# EAGLE design Steuerplatine (EAGLE 9.4.2)
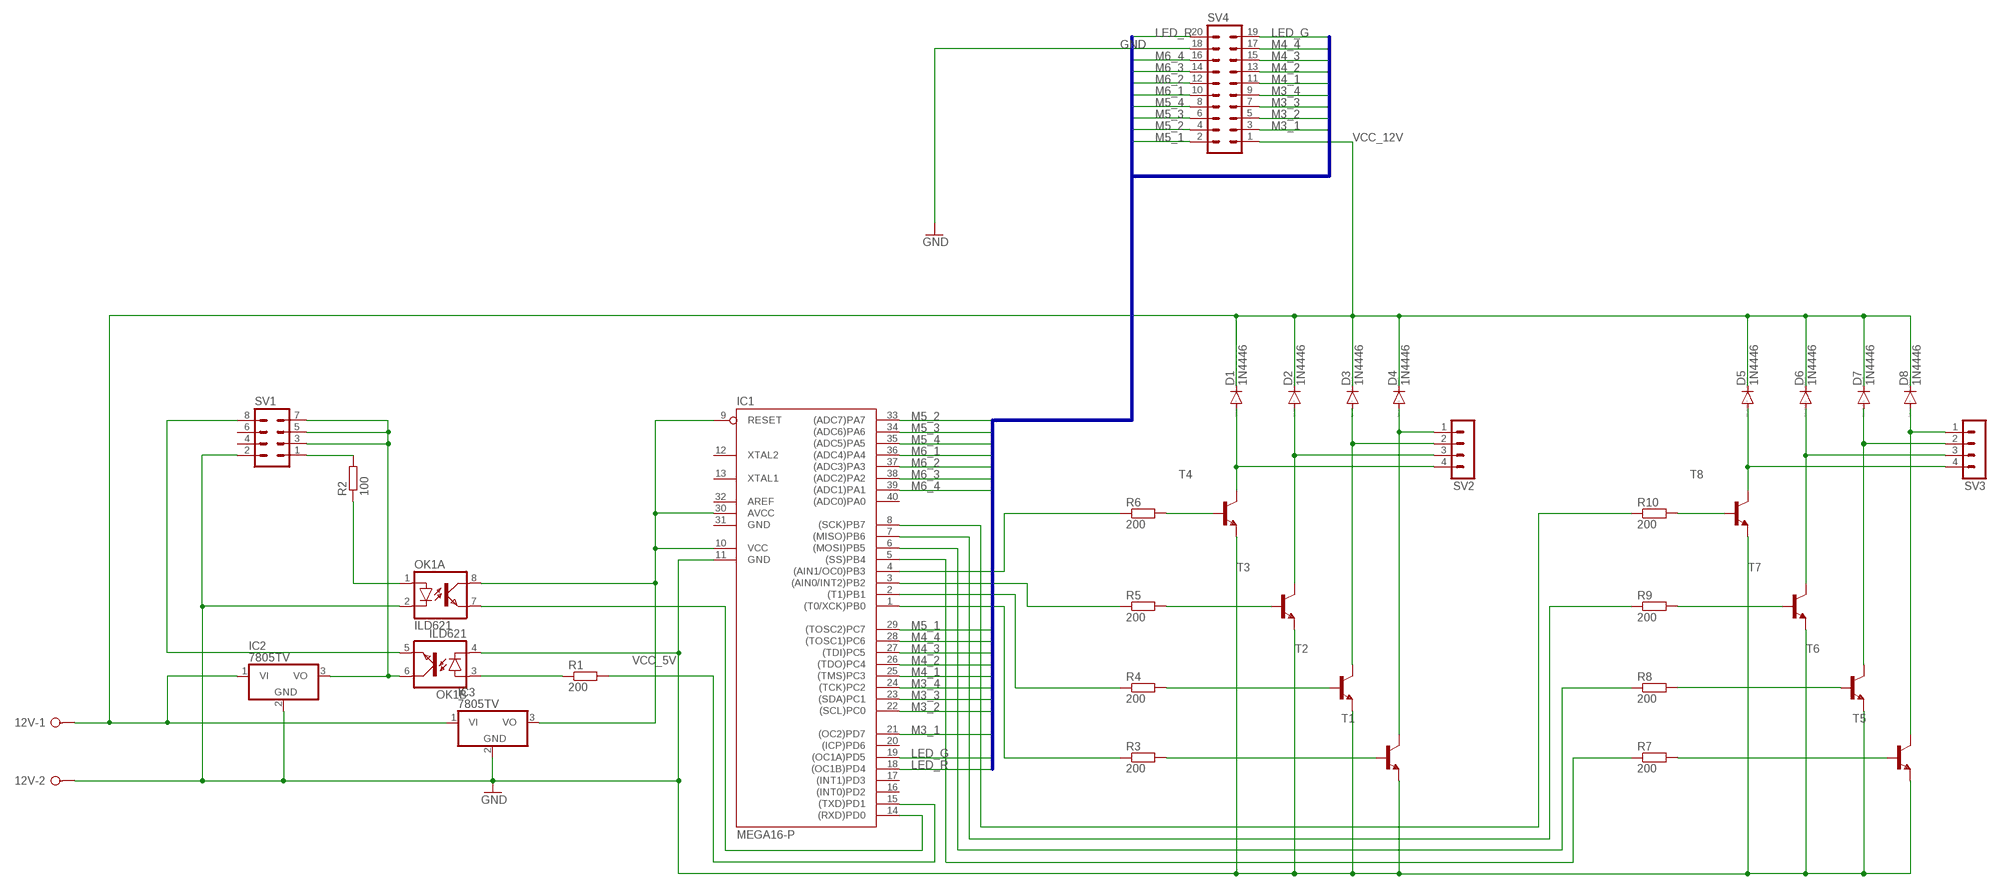
[diagram p0: schematic, sheet 1]

## Parts
12V  W237-02P  [W237-132]
D1  1N4446  [DO35-10]
D2  1N4446  [DO35-10]
D3  1N4446  [DO35-10]
D4  1N4446  [DO35-10]
D5  1N4446  [DO35-10]
D6  1N4446  [DO35-10]
D7  1N4446  [DO35-10]
D8  1N4446  [DO35-10]
IC1  MEGA16-P  [DIL40]
IC2  7805TV  [TO220V]
IC3  7805TV  [TO220V]
OK1  ILD621  [DIL08]
R1  200  R-EU_0207/10  [0207/10]
R2  100  R-EU_0207/10  [0207/10]
R3  200  R-EU_0207/10  [0207/10]
R4  200  R-EU_0207/10  [0207/10]
R5  200  R-EU_0207/10  [0207/10]
R6  200  R-EU_0207/10  [0207/10]
R7  200  R-EU_0207/10  [0207/10]
R8  200  R-EU_0207/10  [0207/10]
R9  200  R-EU_0207/10  [0207/10]
R10  200  R-EU_0207/10  [0207/10]
SV1  MA04-2  [MA04-2]
SV2  MA04-1  [MA04-1]
SV3  MA04-1  [MA04-1]
SV4  MA10-2  [MA10-2]
T1  -NPN-TO126V  [TO126V]
T2  -NPN-TO126V  [TO126V]
T3  -NPN-TO126V  [TO126V]
T4  -NPN-TO126V  [TO126V]
T5  -NPN-TO126V  [TO126V]
T6  -NPN-TO126V  [TO126V]
T7  -NPN-TO126V  [TO126V]
T8  -NPN-TO126V  [TO126V]

## Nets
GND: 12V.2 IC1.11(GND) IC2.2(GND) IC3.2(GND) OK1.2(A:C) OK1.4(B:C) SV1.2 SV4.18 T1.1(E) T2.1(E) T3.1(E) T4.1(E) T5.1(E) T6.1(E) T7.1(E) T8.1(E)
LED_G: IC1.19((OC1A)PD5) SV4.19
LED_R: IC1.18((OC1B)PD4) SV4.20
M3_1: IC1.21((OC2)PD7) SV4.3
M3_2: IC1.22((SCL)PC0) SV4.5
M3_3: IC1.23((SDA)PC1) SV4.7
M3_4: IC1.24((TCK)PC2) SV4.9
M4_1: IC1.25((TMS)PC3) SV4.11
M4_2: IC1.26((TDO)PC4) SV4.13
M4_3: IC1.27((TDI)PC5) SV4.15
M4_4: IC1.28((TOSC1)PC6) SV4.17
M5_1: IC1.29((TOSC2)PC7) SV4.2
M5_2: IC1.33((ADC7)PA7) SV4.4
M5_3: IC1.34((ADC6)PA6) SV4.6
M5_4: IC1.35((ADC5)PA5) SV4.8
M6_1: IC1.36((ADC4)PA4) SV4.10
M6_2: IC1.37((ADC3)PA3) SV4.12
M6_3: IC1.38((ADC2)PA2) SV4.14
M6_4: IC1.39((ADC1)PA1) SV4.16
N$1: R10.2 T8.3(B)
N$2: IC2.3(VO) OK1.6(B:COL) SV1.3 SV1.5 SV1.7
N$3: R2.2 SV1.1
N$4: IC1.14((RXD)PD0) OK1.7(A:EMIT)
N$5: IC1.15((TXD)PD1) R1.2
N$6: OK1.3(B:A) R1.1
N$7: OK1.5(B:EMIT) SV1.8
N$8: OK1.1(A:A) R2.1
N$9: R6.2 T4.3(B)
N$10: R5.2 T3.3(B)
N$11: R4.2 T2.3(B)
N$12: R3.2 T1.3(B)
N$13: IC1.1((T0/XCK)PB0) R3.1
N$14: IC1.2((T1)PB1) R4.1
N$15: IC1.3((AIN0/INT2)PB2) R5.1
N$16: IC1.4((AIN1/OC0)PB3) R6.1
N$18: D3.A SV2.2 T2.2(C)
N$19: D4.A SV2.1 T1.2(C)
N$20: D2.A SV2.3 T3.2(C)
N$21: D1.A SV2.4 T4.2(C)
N$24: R9.2 T7.3(B)
N$25: R8.2 T6.3(B)
N$26: R7.2 T5.3(B)
N$27: D6.A SV3.3 T7.2(C)
N$28: IC1.5((SS)PB4) R7.1
N$29: IC1.6((MOSI)PB5) R8.1
N$30: IC1.7((MISO)PB6) R9.1
N$31: IC1.8((SCK)PB7) R10.1
N$32: D7.A SV3.2 T6.2(C)
N$33: D8.A SV3.1 T5.2(C)
N$35: D5.A SV3.4 T8.2(C)
VCC_5V: IC1.9(RESET) IC1.10(VCC) IC1.30(AVCC) IC3.3(VO) OK1.8(A:COL)
VCC_12V: 12V.1 D1.C D2.C D3.C D4.C D5.C D6.C D7.C D8.C IC2.1(VI) IC3.1(VI) SV4.1
Unconnected: IC1.12(XTAL2) IC1.13(XTAL1) IC1.16((INT0)PD2) IC1.17((INT1)PD3) IC1.20((ICP)PD6) IC1.32(AREF) IC1.40((ADC0)PA0) SV1.4 SV1.6

## Buses
LED_G,LED_R,M3_1,M3_2,M3_3,M3_4,M4_1,M4_2,M4_3,M4_4,M5_1,M5_2,M5_3,M5_4,M6_1,M6_2,M6_3,M6_4

## Power pins joined to a net without a drawn wire
GND: IC1.31(GND)

## Library data of the parts
12V = con-wago-508:W237-02P: WAGO SREW CLAMP; OC_FARNELL: unknown; OC_NEWARK: unknown
D1-D8 = diode:1N4446: DIODE high speed (Philips)
IC1 = atmel:MEGA16-P: MICROCONTROLLER 16 Kbytes FLASH 1 kbytes SRAM 512 bytes EEPROM USART 8-channel 10 bit ADC Source: avr.lbr; MPN: ATMEGA16-16PU; OC_FARNELL: 9171142; OC_NEWARK: 01M6885
IC2 IC3 = linear:78*: Positive VOLTAGE REGULATOR Source: http://cache.national.com/ds/LM/LM78L05.pdf http://www.fairchildsemi.com/ds/LM/LM7805.pdf
OK1 = optocoupler:ILD621: SIEMENS OPTO COUPLER; MF: VISHAY/TELEFUNKEN; MPN: ILD621; OC_FARNELL: 1020151; OC_NEWARK: 58K1678
R1-R10 = resistor:R-EU_: RESISTOR, European symbol
SV1 = con-lstb:MA04-2: PIN HEADER; OC_FARNELL: unknown; OC_NEWARK: unknown
SV2 SV3 = con-lstb:MA04-1: PIN HEADER; OC_FARNELL: unknown; OC_NEWARK: unknown
SV4 = con-lstb:MA10-2: PIN HEADER; OC_FARNELL: unknown; OC_NEWARK: unknown
T1-T8 = transistor:*-NPN-: NPN Transistror BF959 corrected 2008.03.06

## Board
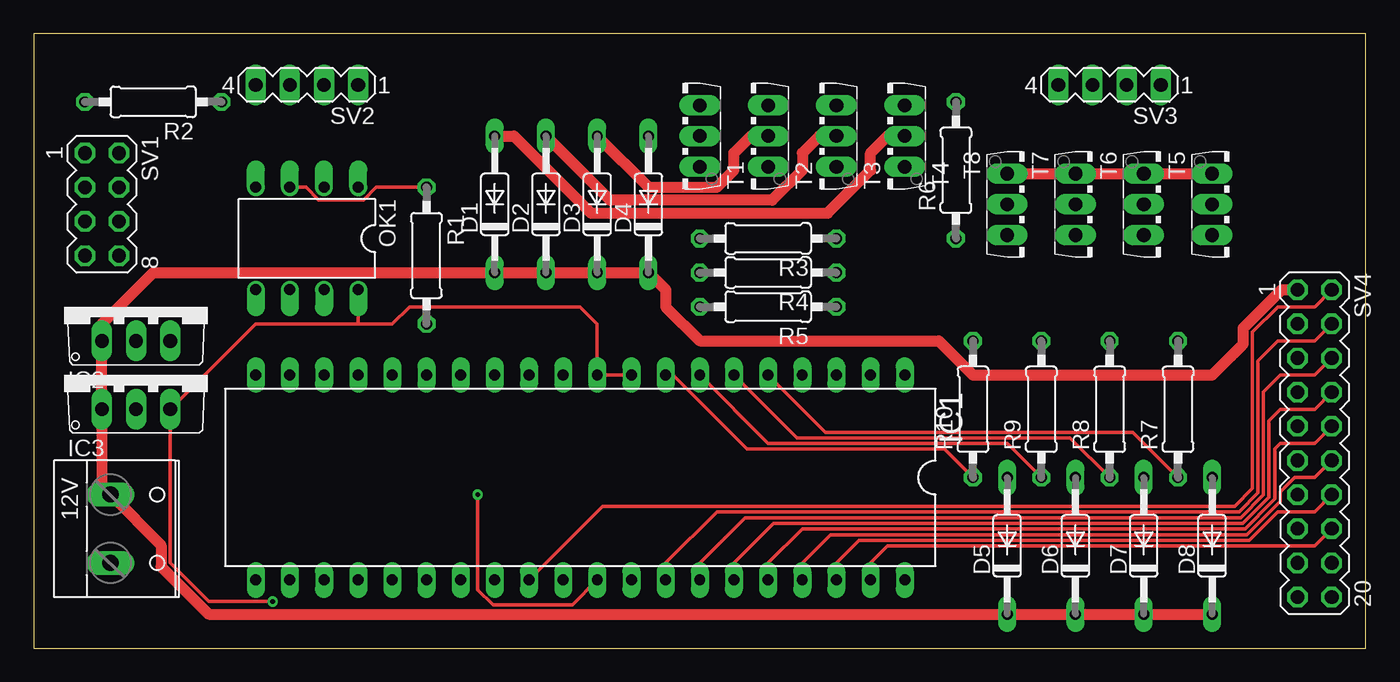
[diagram p1: board, top side]
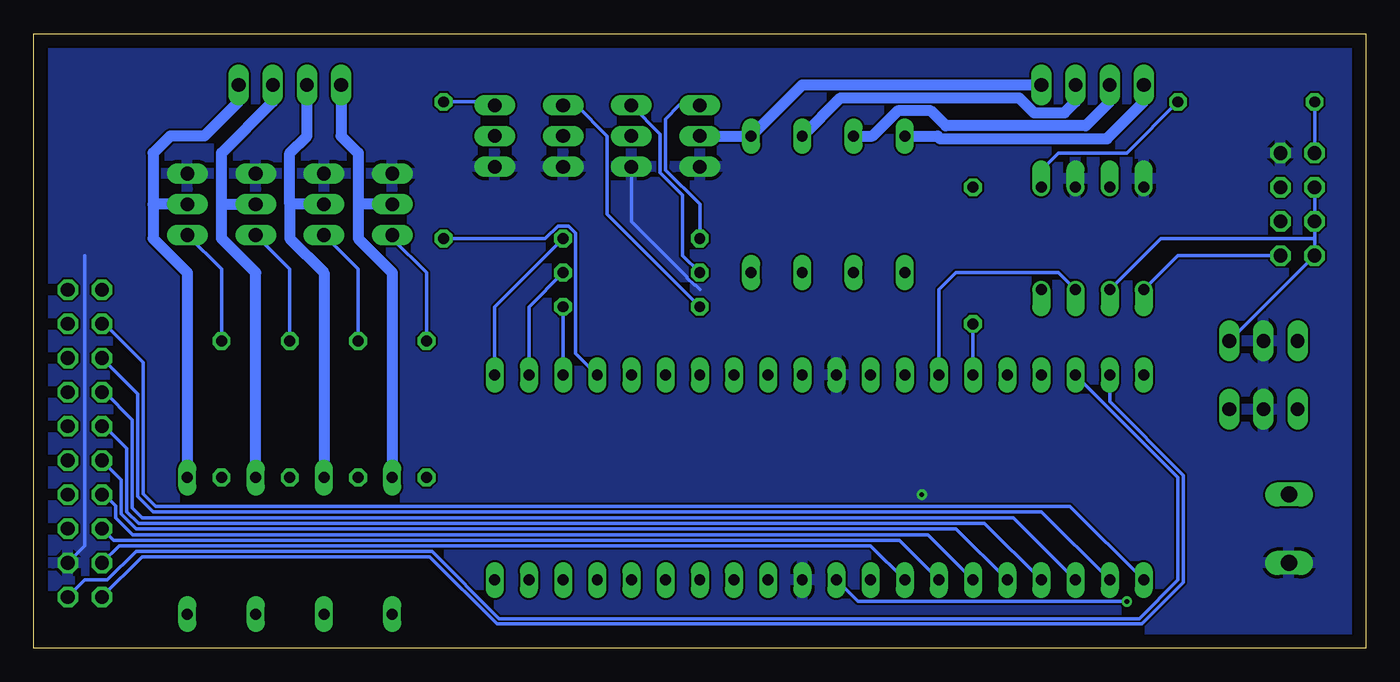
[diagram p2: board, bottom side, seen from below]

Size 99.06 x 45.72 mm. Coordinates in mm from the lower left corner, seen from the top.
Outline: 0,0 99.06,0 99.06,45.72 0,45.72 0,0
Copper layers (1*16): Top 0.035mm / dielectric 1.5mm / Bottom 0.035mm
Design rules "default": minimum track width 6mil, minimum drill 0.35mm, track to track 6mil, track to pad 6mil, pad to pad 6mil, via to via 6mil, smd to smd 6mil, copper to edge 40mil, drill to drill 6mil, minimum pad ring 10mil, minimum via ring 8mil, stop-mask expansion 4mil, vias tented up to drill 0mil, thermal gap 10mil

### Footprints (pad centres in the part's own frame; a part is rotated, then mirrored left to right if it is on the bottom)
W237-132 = drill 1.194 long: 1 -2.54,-0.635; 2 2.54,-0.635
DO35-10 = drill 0.813 long: A 5.08,0; C -5.08,0
DIL40 = drill 0.813 long: 1 -24.13,-7.62; 2 -21.59,-7.62; 3 -19.05,-7.62; 4 -16.51,-7.62; 5 -13.97,-7.62; 6 -11.43,-7.62; 7 -8.89,-7.62; 8 -6.35,-7.62; 9 -3.81,-7.62; 10 -1.27,-7.62; 11 1.27,-7.62; 12 3.81,-7.62; 13 6.35,-7.62; 14 8.89,-7.62; 15 11.43,-7.62; 16 13.97,-7.62; 17 16.51,-7.62; 18 19.05,-7.62; 19 21.59,-7.62; 20 24.13,-7.62; 21 24.13,7.62; 22 21.59,7.62; 23 19.05,7.62; 24 16.51,7.62; 25 13.97,7.62; 26 11.43,7.62; 27 8.89,7.62; 28 6.35,7.62; 29 3.81,7.62; 30 1.27,7.62; 31 -1.27,7.62; 32 -3.81,7.62; 33 -6.35,7.62; 34 -8.89,7.62; 35 -11.43,7.62; 36 -13.97,7.62; 37 -16.51,7.62; 38 -19.05,7.62; 39 -21.59,7.62; 40 -24.13,7.62
TO220V = drill 1.016 long: 1 -2.54,-2.54; 2 0,-2.54; 3 2.54,-2.54
DIL08 = drill 0.813 offset: 1 -3.81,-3.81; 2 -1.27,-3.81; 3 1.27,-3.81; 4 3.81,-3.81; 5 3.81,3.81; 6 1.27,3.81; 7 -1.27,3.81; 8 -3.81,3.81
0207/10 = drill 0.813 octagon: 1 -5.08,0; 2 5.08,0
MA04-2 = drill 1.016 octagon: 1 -3.81,-1.27; 2 -3.81,1.27; 3 -1.27,-1.27; 4 -1.27,1.27; 5 1.27,-1.27; 6 1.27,1.27; 7 3.81,-1.27; 8 3.81,1.27
MA04-1 = drill 1.016 long: 1 -3.81,0; 2 -1.27,0; 3 1.27,0; 4 3.81,0
MA10-2 = drill 1.016 octagon: 1 -11.43,-1.27; 2 -11.43,1.27; 3 -8.89,-1.27; 4 -8.89,1.27; 5 -6.35,-1.27; 6 -6.35,1.27; 7 -3.81,-1.27; 8 -3.81,1.27; 9 -1.27,-1.27; 10 -1.27,1.27; 11 1.27,-1.27; 12 1.27,1.27; 13 3.81,-1.27; 14 3.81,1.27; 15 6.35,-1.27; 16 6.35,1.27; 17 8.89,-1.27; 18 8.89,1.27; 19 11.43,-1.27; 20 11.43,1.27
TO126V = drill 1.016 long: 1 -2.286,-1.27; 2 0,-1.27; 3 2.286,-1.27

### Placement (x,y rotation side)
12V  6.35,8.89 270 top
D1  34.29,33.02 90 top
D2  38.1,33.02 90 top
D3  41.91,33.02 90 top
D4  45.72,33.02 90 top
D5  72.39,7.62 90 top
D6  77.47,7.62 90 top
D7  82.55,7.62 90 top
D8  87.63,7.62 90 top
IC1  40.64,12.7 180 top
IC2  7.62,25.4 0 top
IC3  7.62,20.32 0 top
OK1  20.32,30.48 180 top
R1  29.21,29.21 270 top
R2  8.89,40.64 180 top
R3  54.61,30.48 180 top
R4  54.61,27.94 180 top
R5  54.61,25.4 180 top
R6  68.58,35.56 90 top
R7  85.09,17.78 90 top
R8  80.01,17.78 90 top
R9  74.93,17.78 90 top
R10  69.85,17.78 90 top
SV1  5.08,33.02 270 top
SV2  20.32,41.91 180 top
SV3  80.01,41.91 180 top
SV4  95.25,15.24 270 top
T1  48.26,38.1 90 top
T2  53.34,38.1 90 top
T3  58.42,38.1 90 top
T4  63.5,38.1 90 top
T5  88.9,33.02 270 top
T6  83.82,33.02 270 top
T7  78.74,33.02 270 top
T8  73.66,33.02 270 top

### Tracks (layer width: path | path; a pad name or v marks a point on that pad's centre or on a via)
GND  (via drill 0.35)
  Top 0.254: IC1.31 40.06,3.23 34.16,3.23 33.02,4.36 v33.02,11.43
  Top 0.813: T8.1 T7.1 T6.1 T5.1
  Bottom 0.254: SV4.18 95.25,7.62 95.25,29.21 | T2.1 54.61,31.75 50.47,27.61 50.47,27.55 49.92,27 49.86,27 49.53,26.67
  pour Bottom: 1.27,44.45 97.79,44.45 97.79,1.27 1.27,1.27
LED_G
  Bottom 0.254: IC1.19 19.05,18.36 13.56,12.87 13.56,4.91 16.67,1.8 64.61,1.8 69.61,6.81 90.98,6.81 SV4.19
LED_R
  Bottom 0.254: IC1.18 13.97,12.7 13.97,5.08 16.84,2.21 64.44,2.21 69.44,7.21 91.44,7.21 93.57,5.08 95.25,5.08 SV4.20
M3_1
  Bottom 0.254: IC1.21 22,10.57 90,10.57 90.91,11.47 90.91,21.26 93.78,24.13 SV4.3
M3_2
  Bottom 0.254: IC1.22 24.13,10.16 90.17,10.16 91.31,11.3 91.31,18.92 SV4.5
M3_3
  Bottom 0.254: IC1.23 26.21,9.7 90.98,9.7 91.72,10.44 91.72,16.99 93.78,19.05 SV4.7
M3_4
  Bottom 0.254: IC1.24 28.35,9.3 91.26,9.3 92.13,10.16 92.13,14.86 93.78,16.51 SV4.9
M4_1
  Bottom 0.254: IC1.25 30.48,8.89 91.44,8.89 92.53,9.98 92.53,12.52 SV4.11
M4_2
  Bottom 0.254: IC1.26 32.56,8.43 91.68,8.43 92.94,9.69 92.94,10.59 93.78,11.43 SV4.13
M4_3
  Bottom 0.254: IC1.27 34.7,8.03 93.12,8.03 SV4.15
M4_4
  Bottom 0.254: SV4.17 92.71,7.62 36.83,7.62 IC1.28
M5_1
  Top 0.254: IC1.29 42.32,10.57 89.31,10.57 90.63,11.89 90.63,23.52 92.51,25.4 95.25,25.4 SV4.2
M5_2
  Top 0.254: IC1.33 46.99,6.35 50.8,10.16 89.63,10.16 91.03,11.56 91.03,21.39 92.51,22.86 95.25,22.86 SV4.4
M5_3
  Top 0.254: IC1.34 49.53,6.35 52.88,9.7 89.75,9.7 91.44,11.39 91.44,19.05 92.71,20.32 95.25,20.32 SV4.6
M5_4
  Top 0.254: IC1.35 52.07,6.35 55.02,9.3 89.92,9.3 91.85,11.22 91.85,16.92 92.71,17.78 95.25,17.78 SV4.8
M6_1
  Top 0.254: IC1.36 54.61,6.35 57.15,8.89 90.09,8.89 92.03,10.84 92.3,11.11 92.3,14.83 92.71,15.24 95.25,15.24 SV4.10
M6_2
  Top 0.254: IC1.37 57.15,6.35 59.23,8.43 90.2,8.43 92.71,10.94 92.71,11.63 93.78,12.7 95.25,12.7 SV4.12
M6_3
  Top 0.254: IC1.38 59.69,6.35 61.37,8.03 90.37,8.03 92.51,10.16 95.25,10.16 SV4.14 96.29,11.2
M6_4
  Top 0.254: IC1.39 62.23,6.35 63.5,7.62 95.25,7.62 SV4.16
N$1
  Bottom 0.254: T8.3 72.39,30.48 69.85,27.94 R10.2
N$2
  Bottom 0.254: SV1.3 SV1.5 3.81,30.48 | 3.81,30.48 SV1.7 IC2.3 | OK1.6 15.24,30.48 3.81,30.48
N$3
  Bottom 0.254: R2.2 SV1.1
N$4
  Bottom 0.254: IC1.14 31.75,26.67 30.48,27.94 22.86,27.94 OK1.7
N$5
  Bottom 0.254: R1.2 IC1.15
N$6
  Top 0.254: OK1.3 20.26,34.29 21.2,33.35 24.52,33.35 25.46,34.29 R1.1
N$7
  Bottom 0.254: SV1.8 13.97,29.21 OK1.5
N$8
  Bottom 0.254: R2.1 17.78,36.83 22.86,36.83 24.13,35.56 OK1.1
N$9
  Bottom 0.254: T4.3 65.02,40.64 R6.2
N$10
  Bottom 0.254: R5.2 56.41,32.28 56.41,38.1 58.7,40.39 T3.3
N$11
  Bottom 0.254: T2.3 52.48,38.25 52.48,35.39 50.8,33.72 50.8,29.21 R4.2
N$12
  Bottom 0.254: R3.2 49.53,33.02 52.07,35.56 52.07,39.37 51.05,40.39 T1.3
N$13
  Bottom 0.254: R3.1 64.77,25.4 IC1.1
N$14
  Bottom 0.254: R4.1 62.23,25.4 IC1.2
N$15
  Bottom 0.254: R5.1 IC1.3
N$16
  Bottom 0.254: IC1.4 58.75,21.92 58.75,30.87 59.3,31.42 60.08,31.42 61.02,30.48 R6.1
N$18
  Top 0.813: D3.A 45.72,34.29 50.8,34.29 52.07,35.56 52.07,36.83 53.34,38.1 T2.2
  Bottom 0.813: D3.A 39.06,40.95 25.8,40.95 24.68,39.83 22.4,39.83 21.59,40.64 SV2.2
N$19
  Bottom 0.813: T1.2 D4.A 41.91,41.91 SV2.1
N$20
  Top 0.813: T3.2 58.42,38.1 57.15,36.83 57.15,35.56 54.91,33.33 42.88,33.33 D2.A
  Bottom 0.813: D2.A 36.67,38.1 34.8,39.98 32.36,39.98 31.24,38.86 20.83,38.86 19.05,40.64 SV2.3
N$21
  Top 0.813: D1.A 35.72,38.1 41.46,32.36 59.03,32.36 62.23,35.56 62.23,36.83 63.5,38.1 T4.2
  Bottom 0.813: SV2.4 16.51,40.64 19.25,37.9 31.64,37.9 31.84,38.1 D1.A
N$24
  Bottom 0.254: T7.3 74.93,28.19 R9.2
N$25
  Bottom 0.254: T6.3 80.01,28.19 R8.2
N$26
  Bottom 0.254: T5.3 85.09,28.19 R7.2
N$27
  Bottom 0.813: T7.2 80.01,33.02 | 80.01,33.02 80.01,36.83 78.74,38.1 SV3.3 | 80.01,33.02 80.01,30.48 77.47,27.94 D6.A
N$28
  Top 0.254: IC1.5 58.88,16.05 81.74,16.05 R7.1
N$29
  Top 0.254: IC1.6 56.74,15.65 77.06,15.65 R8.1
N$30
  Top 0.254: IC1.7 54.61,15.24 72.39,15.24 R9.1
N$31
  Top 0.254: IC1.8 47.54,20.32 53.03,14.83 67.72,14.83 R10.1
N$32
  Bottom 0.813: D7.A 82.55,27.94 85.09,30.48 85.09,33.02 | 85.09,33.02 T6.2 | 85.09,33.02 85.09,36.83 81.28,40.64 SV3.2
N$33
  Bottom 0.813: SV3.1 83.82,40.64 86.36,38.1 88.9,38.1 90.17,36.83 90.17,33.02 | D8.A 87.63,27.94 90.17,30.48 90.17,33.02 | T5.2 90.17,33.02
N$35
  Bottom 0.813: SV3.4 76.2,38.1 74.93,36.83 74.93,33.02 | D5.A 72.39,27.94 74.93,30.48 74.93,33.02 | T8.2 74.93,33.02
VCC_5V  (via drill 0.35)
  Top 0.254: 24.13,24.13 16.51,24.13 IC3.3 10.16,6.35 13.03,3.48 v17.78,3.48 | 24.13,24.13 26.67,24.13 27.94,25.4 40.64,25.4 41.91,24.13 IC1.10 IC1.9 | OK1.8 24.13,24.13
  Bottom 0.254: IC1.30 37.77,3.48 v17.78,3.48
VCC_12V
  Top 0.813: SV4.1 92.81,26.67 89.94,23.8 89.94,22.63 87.63,20.32 69.85,20.32 67.31,22.86 49.53,22.86 46.99,25.4 46.99,26.67 D4.C D3.C D2.C D1.C 8.89,27.94 5.08,24.13 IC2.1 IC3.1 5.08,12.06 12V.1 9.47,7.67 9.47,6.07 13,2.54 D5.C D6.C D7.C D8.C